# EAGLE design RoverBaseboard (EAGLE 6.4)
DATABASE: /home/mes/eagle/PARTSDB.txt
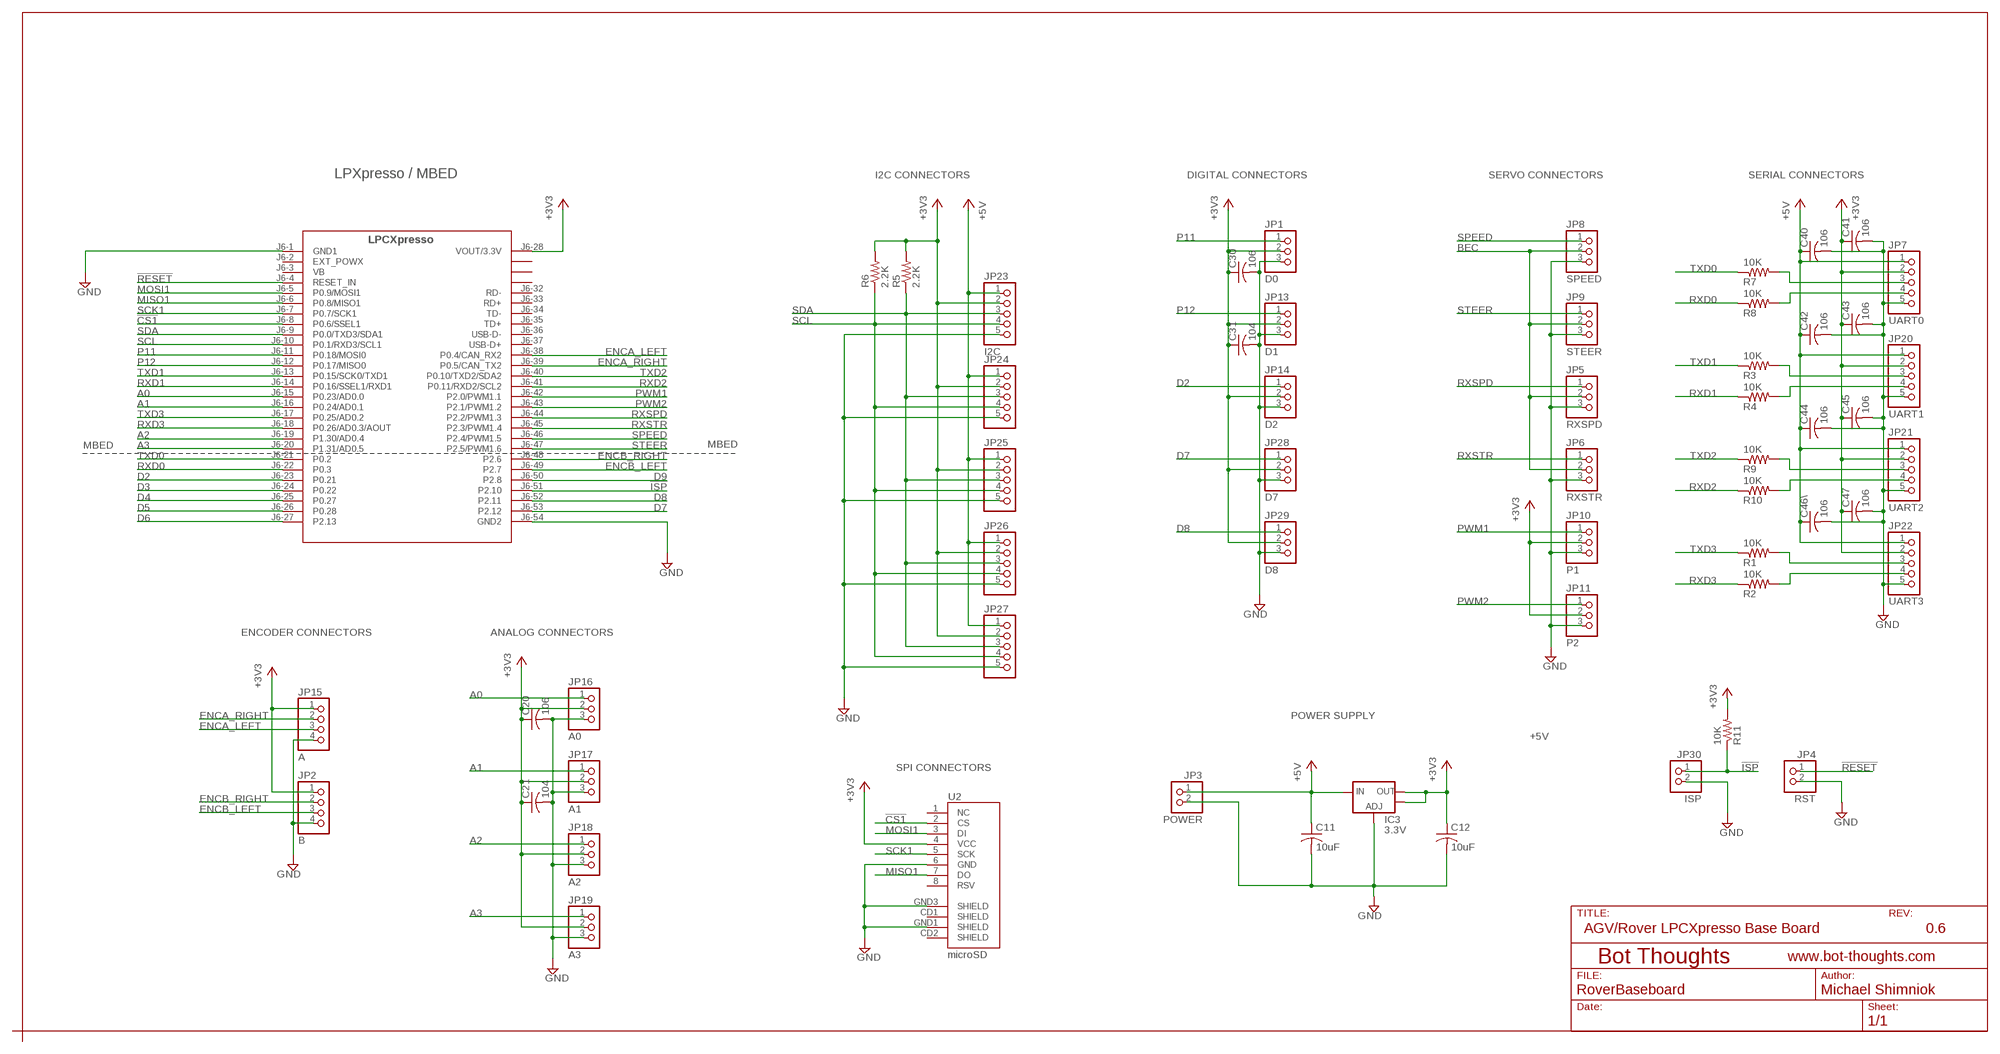
[diagram p0: schematic, sheet 1]

## Parts
C11  10uF  C-USC1206  [C1206]
C12  10uF  C-USC1206  [C1206]
C20  106  C-USC0603  [C0603]
C21  104  C-USC0603  [C0603]
C30  106  C-USC0603  [C0603]
C31  104  C-USC0603  [C0603]
C40  106  C-USC0603  [C0603]
C41  106  C-USC0603  [C0603]
C42  106  C-USC0603  [C0603]
C43  106  C-USC0603  [C0603]
C44  106  C-USC0603  [C0603]
C45  106  C-USC0603  [C0603]
C46\  106  C-USC0603  [C0603]
C47  106  C-USC0603  [C0603]
IC3  3.3V  V_REG_LM1117SOT223  [SOT223]
JP1  D0  PINHD-1X03_2.54-S  [1X03-S]
JP2  B  PINHD-1X04_2.54-S  [1X04-S]
JP3  POWER  PINHD-1X02_2.54-S  [1X02-S]
JP4  RST  PINHD-1X02_2.54-S  [1X02-S]
JP5  RXSPD  PINHD-1X03_2.54-S  [1X03-S]
JP6  RXSTR  PINHD-1X03_2.54-S  [1X03-S]
JP7  UART0  PINHD-1X05_2.54-S  [1X05-S]
JP8  SPEED  PINHD-1X03_2.54-S  [1X03-S]
JP9  STEER  PINHD-1X03_2.54-S  [1X03-S]
JP10  P1  PINHD-1X03_2.54-S  [1X03-S]
JP11  P2  PINHD-1X03_2.54-S  [1X03-S]
JP13  D1  PINHD-1X03_2.54-S  [1X03-S]
JP14  D2  PINHD-1X03_2.54-S  [1X03-S]
JP15  A  PINHD-1X04_2.54-S  [1X04-S]
JP16  A0  PINHD-1X03_2.54-S  [1X03-S]
JP17  A1  PINHD-1X03_2.54-S  [1X03-S]
JP18  A2  PINHD-1X03_2.54-S  [1X03-S]
JP19  A3  PINHD-1X03_2.54-S  [1X03-S]
JP20  UART1  PINHD-1X05_2.54-S  [1X05-S]
JP21  UART2  PINHD-1X05_2.54-S  [1X05-S]
JP22  UART3  PINHD-1X05_2.54-S  [1X05-S]
JP23  I2C  PINHD-1X05_2.54-S  [1X05-S]
JP24  PINHD-1X05_2.54-S  [1X05-S]
JP25  PINHD-1X05_2.54-S  [1X05-S]
JP26  PINHD-1X05_2.54-S  [1X05-S]
JP27  PINHD-1X05_2.54-S  [1X05-S]
JP28  D7  PINHD-1X03_2.54-S  [1X03-S]
JP29  D8  PINHD-1X03_2.54-S  [1X03-S]
JP30  ISP  PINHD-1X02_2.54-S  [1X02-S]
R1  10K  R-US_R0603  [R0603]
R2  10K  R-US_R0603  [R0603]
R3  10K  R-US_R0603  [R0603]
R4  10K  R-US_R0603  [R0603]
R5  2.2K  R-US_R0603  [R0603]
R6  2.2K  R-US_R0603  [R0603]
R7  10K  R-US_R0603  [R0603]
R8  10K  R-US_R0603  [R0603]
R9  10K  R-US_R0603  [R0603]
R10  10K  R-US_R0603  [R0603]
R11  10K  R-US_R0603  [R0603]
U2  microSD  USD-SOCKETNEW  [MICRO-SD-SOCKET-PP]
U$1  LPCXPRESSO  LPCXPRESSO_NO_PAD_1768_REVB  [LPCXPRESSO_NO_PAD]

## Nets
!CS1: U2.2(CS) U$1.J6-8(P0.6/SSEL1)
!ISP: JP30.1 R11.1 U$1.J6-51(P2.10)
!RESET: JP4.1 U$1.J6-4(RESET_IN)
+3V3: C12.1 C20.1 C21.1 C30.1 C31.1 C41.1 C43.1 C45.1 C47.1 IC3.2(OUT) IC3.4(OUT) JP1.2 JP2.1 JP7.2 JP10.2 JP11.2 JP13.2 JP14.2 JP15.1 JP16.2 JP17.2 JP18.2 JP19.2 JP20.2 JP21.2 JP22.2 JP23.2 JP24.2 JP25.2 JP26.2 JP27.2 JP28.2 JP29.2 R5.2 R6.2 R11.2 U2.4(VCC) U$1.J6-28(VOUT/3.3V)
+5V: C11.1 C40.1 C42.1 C44.1 C46\.1 IC3.3(IN) JP3.1 JP7.1 JP20.1 JP21.1 JP22.1 JP23.1 JP24.1 JP25.1 JP26.1 JP27.1
A0: JP16.1 U$1.J6-15(P0.23/AD0.0)
A1: JP17.1 U$1.J6-16(P0.24/AD0.1)
A2: JP18.1 U$1.J6-19(P1.30/AD0.4)
A3: JP19.1 U$1.J6-20(P1.31/AD0.5)
BEC: JP5.2 JP6.2 JP8.2 JP9.2
D2: JP14.1 U$1.J6-23(P0.21)
D3: U$1.J6-24(P0.22)
D4: U$1.J6-25(P0.27)
D5: U$1.J6-26(P0.28)
D6: U$1.J6-27(P2.13)
D7: JP28.1 U$1.J6-53(P2.12)
D8: JP29.1 U$1.J6-52(P2.11)
D9: U$1.J6-50(P2.8)
ENCA_LEFT: JP15.3 U$1.J6-38(P0.4/CAN_RX2)
ENCA_RIGHT: JP15.2 U$1.J6-39(P0.5/CAN_TX2)
ENCB_LEFT: JP2.3 U$1.J6-49(P2.7)
ENCB_RIGHT: JP2.2 U$1.J6-48(P2.6)
GND: C11.2 C12.2 C20.2 C21.2 C30.2 C31.2 C40.2 C41.2 C42.2 C43.2 C44.2 C45.2 C46\.2 C47.2 IC3.1(ADJ) JP1.3 JP2.4 JP3.2 JP4.2 JP5.3 JP6.3 JP7.5 JP8.3 JP9.3 JP10.3 JP11.3 JP13.3 JP14.3 JP15.4 JP16.3 JP17.3 JP18.3 JP19.3 JP20.5 JP21.5 JP22.5 JP23.5 JP24.5 JP25.5 JP26.5 JP27.5 JP28.3 JP29.3 JP30.2 U2.6(GND) U2.GND1(SHIELD) U2.GND3(SHIELD) U$1.J6-1(GND1) U$1.J6-54(GND2)
MISO1: U2.7(DO) U$1.J6-6(P0.8/MISO1)
MOSI1: U2.3(DI) U$1.J6-5(P0.9/MOSI1)
N$1: JP22.3 R1.2
N$2: JP22.4 R2.2
N$6: JP7.3 R7.2
N$7: JP7.4 R8.2
N$9: JP20.3 R3.2
N$10: JP20.4 R4.2
N$16: JP21.3 R9.2
N$17: JP21.4 R10.2
P11: JP1.1 U$1.J6-11(P0.18/MOSI0)
P12: JP13.1 U$1.J6-12(P0.17/MISO0)
PWM1: JP10.1 U$1.J6-42(P2.0/PWM1.1)
PWM2: JP11.1 U$1.J6-43(P2.1/PWM1.2)
RXD0: R8.1 U$1.J6-22(P0.3)
RXD1: R4.1 U$1.J6-14(P0.16/SSEL1/RXD1)
RXD2: R10.1 U$1.J6-41(P0.11/RXD2/SCL2)
RXD3: R2.1 U$1.J6-18(P0.26/AD0.3/AOUT)
RXSPD: JP5.1 U$1.J6-44(P2.2/PWM1.3)
RXSTR: JP6.1 U$1.J6-45(P2.3/PWM1.4)
SCK1: U2.5(SCK) U$1.J6-7(P0.7/SCK1)
SCL: JP23.4 JP24.4 JP25.4 JP26.4 JP27.4 R6.1 U$1.J6-10(P0.1/RXD3/SCL1)
SDA: JP23.3 JP24.3 JP25.3 JP26.3 JP27.3 R5.1 U$1.J6-9(P0.0/TXD3/SDA1)
SPEED: JP8.1 U$1.J6-46(P2.4/PWM1.5)
STEER: JP9.1 U$1.J6-47(P2.5/PWM1.6)
TXD0: R7.1 U$1.J6-21(P0.2)
TXD1: R3.1 U$1.J6-13(P0.15/SCK0/TXD1)
TXD2: R9.1 U$1.J6-40(P0.10/TXD2/SDA2)
TXD3: R1.1 U$1.J6-17(P0.25/AD0.2)
Unconnected: U2.1(NC) U2.8(RSV) U2.CD1(SHIELD) U2.CD2(SHIELD) U$1.J6-2(EXT_POWX) U$1.J6-3(VB) U$1.J6-29 U$1.J6-30 U$1.J6-31 U$1.J6-32(RD-) U$1.J6-33(RD+) U$1.J6-34(TD-) U$1.J6-35(TD+) U$1.J6-36(USB-D-) U$1.J6-37(USB-D+)

## Notes on the sheet
- LPXpresso / MBED | I2C CONNECTORS | DIGITAL CONNECTORS | SERVO CONNECTORS | SERIAL CONNECTORS
- MBED | MBED
- ENCODER CONNECTORS | ANALOG CONNECTORS
- POWER SUPPLY
- SPI CONNECTORS
- AGV/Rover LPCXpresso Base Board | 0.6

## Library data of the parts
C11 C12 C20 C21 C30 C31 C40-C45 C46\ C47 = rcl:C-US: CAPACITOR, American symbol
IC3 = SparkFun:V_REG_LM1117: Voltage Regulator LM1117 Standard adjustable voltage regulator but in SMD form. Spark Fun Electronics SKU : COM-00595
JP1 JP5 JP6 JP8-JP11 JP13 JP14 JP16-JP19 JP28 JP29 = pinhead-2:PINHD-1X03: PIN HEADER; OC_NEWARK: unknown
JP2 JP15 = pinhead-2:PINHD-1X04: PIN HEADER; OC_NEWARK: unknown
JP3 JP4 JP30 = pinhead-2:PINHD-1X02: PIN HEADER; OC_NEWARK: unknown
JP7 JP20-JP27 = pinhead-2:PINHD-1X05: PIN HEADER
R1-R4 R7-R11 = rcl:R-US_: RESISTOR, American symbol; MPN: WCR0805-220RFI; OC_NEWARK: 98K2621
R5 R6 = rcl:R-US_: RESISTOR, American symbol; OC_NEWARK: unknown
U2 = SparkFun:USD-SOCKET: microSD Socket Push-push type uSD socket. Schematic element and footprint production proven. Spark Fun Electronics SKU : PRT-00127. tDoc lines correctly indicate media card edge positions when inserting (unlocked, locked, depressed).
U$1 = LPCXpresso:LPCXPRESSO_NO_PAD: NXP LPCXpresso by Embedded Artists LPCXpresso is a new, low-cost development platform available from NXP. It supports NXP's ARM-based LPC microcontrollers. The platform is comprised of a simplified Eclipse-based IDE and low-cost target boards which include an attached JTAG debugger. http://ics.nxp.com/lpcxpresso/ NOTE: This version does NOT include the 37-pin pads on the top of the board

## Board
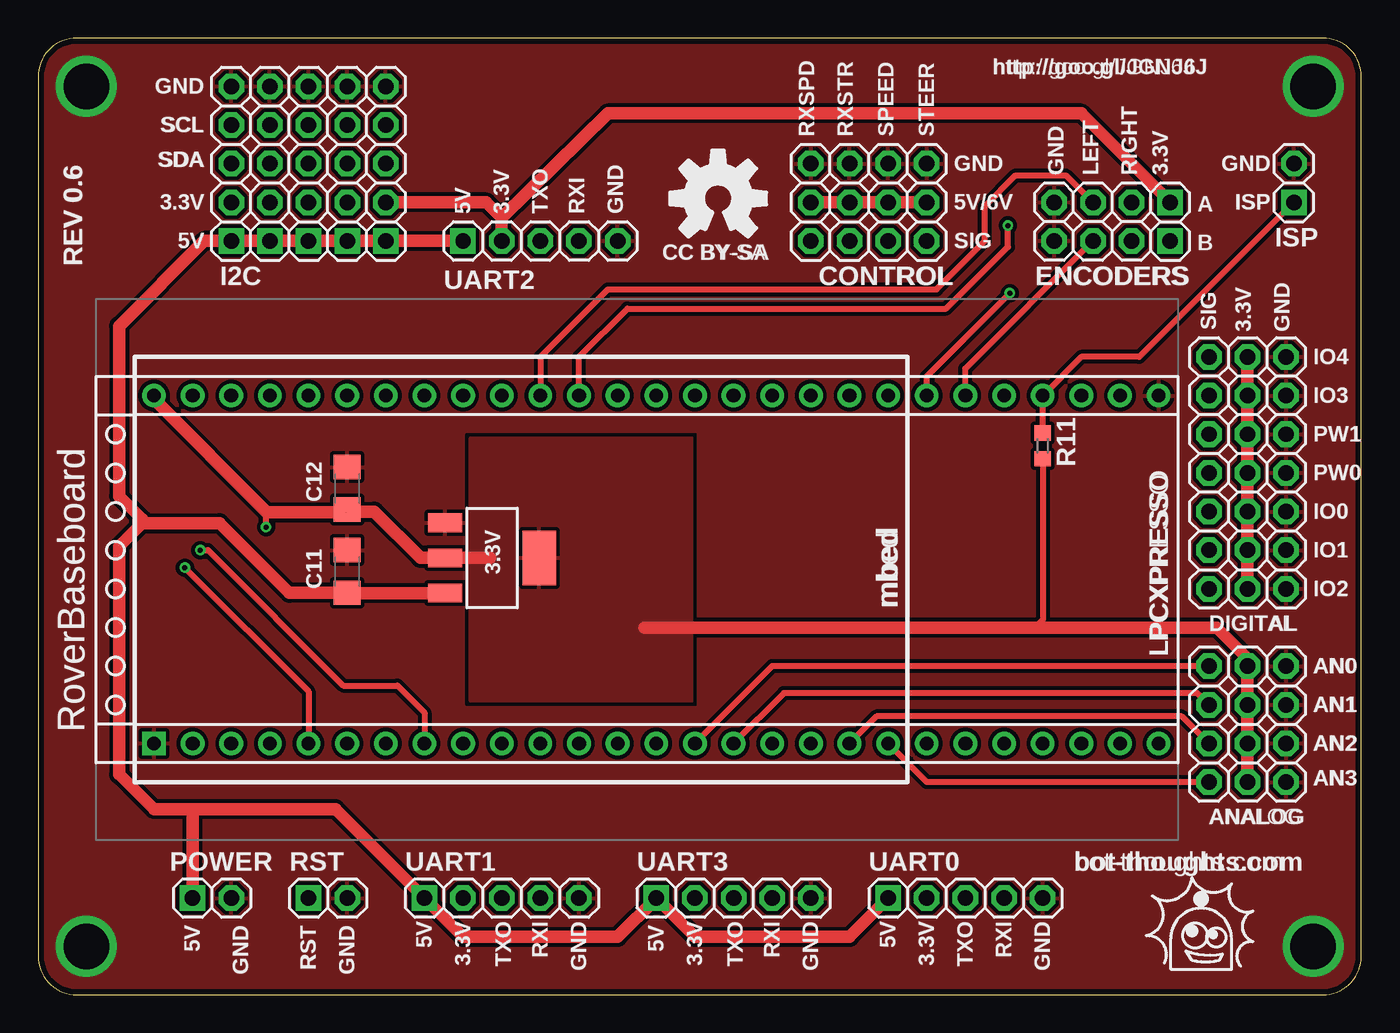
[diagram p1: board, top side]
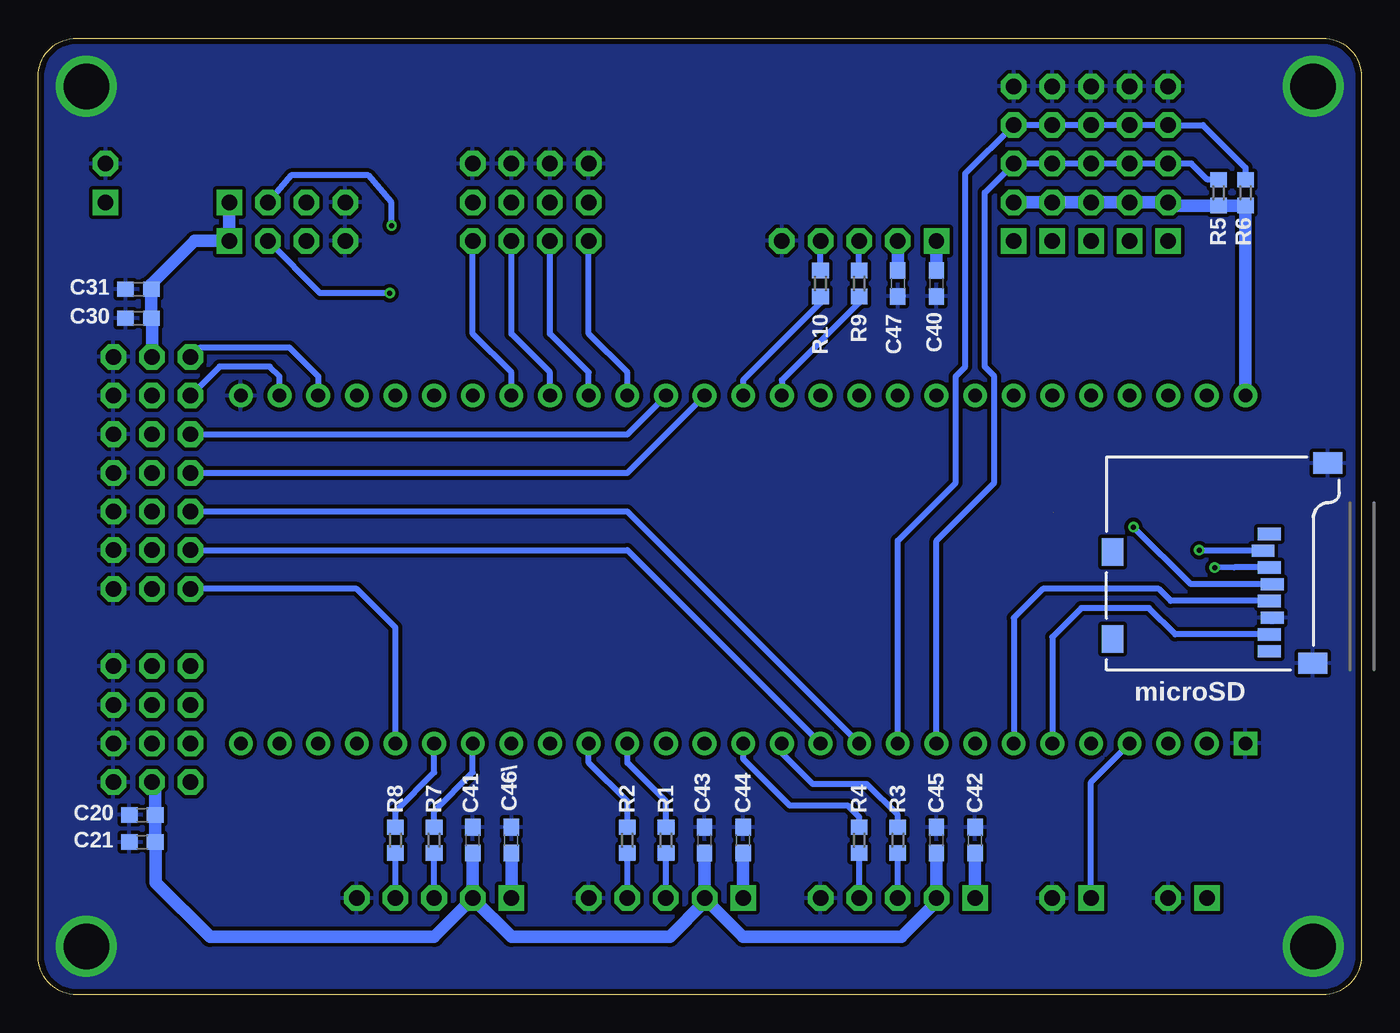
[diagram p2: board, bottom side, seen from below]

Size 87 x 62.87 mm. Coordinates in mm from the lower left corner, seen from the top.
Outline: 0,60.33 0,2.54 arc90 2.54,0 84.45,0 arc90 87,2.54 87,60.33 arc90 84.45,62.87 2.54,62.87 arc90 0,60.33
Copper layers (1*16): Top 0.0356mm / dielectric 1.5011mm / Bottom 0.0356mm
Design rules "default *": minimum track width 6mil, minimum drill 13mil, track to track 6mil, track to pad 6mil, pad to pad 6mil, via to via 6mil, smd to smd 6mil, copper to edge 15mil, drill to drill 6mil, minimum pad ring 13mil, minimum via ring 7mil, stop-mask expansion 4mil, vias tented up to drill 25mil, thermal gap 10mil

### Footprints (pad centres in the part's own frame; a part is rotated, then mirrored left to right if it is on the bottom)
C1206 = smd 1.6 x 1.8: 1 -1.4,0; 2 1.4,0
C0603 = smd 1.1 x 1: 1 -0.85,0; 2 0.85,0
SOT223 = smd 1.219 x 2.235: 1 -2.311,-3.099; 2 0,-3.099; 3 2.311,-3.099 | smd 3.6 x 2.2: 4 0,3.099
1X03-S = drill 1.016 octagon: 1 -2.54,0; 2 0,0; 3 2.54,0
1X04-S = drill 1.016 square: 1 -3.81,0 | drill 1.016 octagon: 2 -1.27,0; 3 1.27,0; 4 3.81,0
1X02-S = drill 1.016 square: 1 -1.27,0 | drill 1.016 octagon: 2 1.27,0
1X05-S = drill 1.016 square: 1 -5.08,0 | drill 1.016 octagon: 2 -2.54,0; 3 0,0; 4 2.54,0; 5 5.08,0
R0603 = smd 1 x 1.1: 1 -0.85,0; 2 0.85,0
MICRO-SD-SOCKET-PP = smd 0.8 x 1.5: 1 -8.94,10.7; 2 -7.84,10.3; 3 -6.74,10.7; 4 -5.64,10.9; 5 -4.54,10.7; 6 -3.44,10.9; 7 -2.34,10.7; 8 -1.24,10.7 | smd 1.8 x 1.4: CD1 -2.05,0.4; CD2 -7.75,0.4 | smd 1.4 x 1.9: GND1 -13.6,14.55; GND3 -0.45,13.55
LPCXPRESSO_NO_PAD = drill 0.9 pad 1.422 square: J6-1 -33.02,-11.43 | drill 0.9 pad 1.422: J6-2 -30.48,-11.43; J6-3 -27.94,-11.43; J6-4 -25.4,-11.43; J6-5 -22.86,-11.43; J6-6 -20.32,-11.43; J6-7 -17.78,-11.43; J6-8 -15.24,-11.43; J6-9 -12.7,-11.43; J6-10 -10.16,-11.43; J6-11 -7.62,-11.43; J6-12 -5.08,-11.43; J6-13 -2.54,-11.43; J6-14 0,-11.43; J6-15 2.54,-11.43; J6-16 5.08,-11.43; J6-17 7.62,-11.43; J6-18 10.16,-11.43; J6-19 12.7,-11.43; J6-20 15.24,-11.43; J6-21 17.78,-11.43; J6-22 20.32,-11.43; J6-23 22.86,-11.43; J6-24 25.4,-11.43; J6-25 27.94,-11.43; J6-26 30.48,-11.43; J6-27 33.02,-11.43; J6-28 -33.02,11.43; J6-29 -30.48,11.43; J6-30 -27.94,11.43; J6-31 -25.4,11.43; J6-32 -22.86,11.43; J6-33 -20.32,11.43; J6-34 -17.78,11.43; J6-35 -15.24,11.43; J6-36 -12.7,11.43; J6-37 -10.16,11.43; J6-38 -7.62,11.43; J6-39 -5.08,11.43; J6-40 -2.54,11.43; J6-41 0,11.43; J6-42 2.54,11.43; J6-43 5.08,11.43; J6-44 7.62,11.43; J6-45 10.16,11.43; J6-46 12.7,11.43; J6-47 15.24,11.43; J6-48 17.78,11.43; J6-49 20.32,11.43; J6-50 22.86,11.43; J6-51 25.4,11.43; J6-52 27.94,11.43; J6-53 30.48,11.43; J6-54 33.02,11.43

### Placement (x,y rotation side)
C11  20.32,27.81 90 top
C12  20.32,33.27 90 top
C20  80.14,11.81 180 bottom
C21  80.14,10.03 180 bottom
C30  80.39,44.45 180 bottom
C31  80.39,46.35 180 bottom
C40  27.94,46.74 270 bottom
C41  58.42,10.16 90 bottom
C42  25.4,10.16 90 bottom
C43  43.18,10.16 90 bottom
C44  40.64,10.16 90 bottom
C45  27.94,10.16 90 bottom
C46\  55.88,10.16 90 bottom
C47  30.48,46.74 270 bottom
IC3  29.84,28.7 270 top
JP1  79.5,31.75 0 top
JP2  70.61,49.53 180 top
JP3  11.43,6.35 0 top
JP4  19.05,6.35 0 top
JP5  50.8,52.07 90 top
JP6  53.34,52.07 90 top
JP7  60.96,6.35 0 top
JP8  55.88,52.07 90 top
JP9  58.42,52.07 90 top
JP10  79.5,34.29 0 top
JP11  79.5,36.83 0 top
JP13  79.5,29.21 0 top
JP14  79.5,26.67 0 top
JP15  70.61,52.07 180 top
JP16  79.5,21.59 0 top
JP17  79.5,19.05 0 top
JP18  79.5,16.51 0 top
JP19  79.5,13.97 0 top
JP20  30.48,6.35 0 top
JP21  33.02,49.53 0 top
JP22  45.72,6.35 0 top
JP23  12.7,54.61 90 top
JP24  15.24,54.61 90 top
JP25  17.78,54.61 90 top
JP26  20.32,54.61 90 top
JP27  22.86,54.61 90 top
JP28  79.5,39.37 0 top
JP29  79.5,41.91 0 top
JP30  82.55,53.34 90 top
R1  45.72,10.16 270 bottom
R2  48.26,10.16 270 bottom
R3  30.48,10.16 270 bottom
R4  33.02,10.16 270 bottom
R5  9.4,52.7 270 bottom
R6  7.62,52.7 270 bottom
R7  60.96,10.16 270 bottom
R8  63.5,10.16 270 bottom
R9  33.02,46.74 90 bottom
R10  35.56,46.74 90 bottom
R11  66.04,36.07 270 top
U2  16.76,21.34 270 bottom
U$1  40.64,27.94 0 top

### Tracks (layer width: path | path; a pad name or v marks a point on that pad's centre or on a via)
!CS1  (via drill 0.33)
  Top 0.406: v10.67,29.21 11.18,29.21 20.07,20.32 23.62,20.32 25.4,18.54 U$1.J6-8
  Bottom 0.406: U2.2 10.63,29.18 v10.67,29.21
!ISP
  Top 0.406: JP30.1 72.39,41.91 68.58,41.91 U$1.J6-51 R11.1
!RESET
  Bottom 0.406: JP4.1 17.78,13.97 U$1.J6-4
+3V3  (via drill 0.33)  (1 unrouted)
  Top 0.406: v14.99,30.73 14.99,31.75 | R11.2 66.04,24.64 65.53,24.13
  Top 0.813: JP29.2 JP28.2 JP11.2 JP10.2 JP1.2 JP13.2 JP14.2 | JP19.2 JP18.2 JP17.2 JP16.2 79.5,22.1 77.47,24.13 65.53,24.13 39.88,24.13 | U$1.J6-28 7.62,39.12 14.99,31.75 15.04,31.7 20.24,31.7 C12.1 | 20.27,31.7 20.32,31.75 22.1,31.75 25.15,28.7 IC3.2 29.72,28.7 | JP15.1 68.58,57.91 37.47,57.91 30.48,51.05 | JP21.2 30.48,51.05 | 30.48,51.05 29.46,52.07 JP27.2
  Bottom 0.406: U2.4 11.23,26.98 v14.99,30.73
  Bottom 0.813: JP27.2 JP26.2 JP25.2 JP24.2 JP23.2 12.48,51.85 R5.2 R6.2 U$1.J6-28 | C45.1 JP20.2 27.94,6.1 30.23,3.81 40.64,3.81 JP22.2 | C41.1 JP7.2 | C47.1 JP21.2 | JP29.2 79.5,44.41 C30.1 C31.1 79.54,46.7 76.71,49.53 JP2.1 JP15.1 | JP19.2 79.29,13.76 C20.1 C21.1 79.25,9.99 79.25,7.37 75.69,3.81 60.96,3.81 JP7.2 | C43.1 JP22.2 | JP22.2 43.18,6.1 45.47,3.81 55.88,3.81 JP7.2
  pour Top (isolate 0.254): 28.45,36.58 42.93,36.58 42.93,19.3 28.45,19.3
+5V
  Top 0.813: JP7.1 53.34,3.81 43.18,3.81 JP22.1 38.1,3.81 27.94,3.81 JP20.1 19.56,12.19 10.29,12.19 | 6.86,31.24 5.33,32.77 5.33,43.94 10.92,49.53 JP23.1 JP24.1 JP25.1 JP26.1 JP27.1 JP21.1 | 6.86,31.24 7.11,30.99 11.94,30.99 16.51,26.41 C11.1 20.34,26.39 IC3.3 | 6.86,31.24 6.86,30.99 5.33,29.46 5.33,14.48 7.62,12.19 10.29,12.19 | JP3.1 10.16,12.06 10.29,12.19
  Bottom 0.813: C42.1 JP20.1 | C44.1 JP22.1 | C46\.1 JP7.1 | C40.1 JP21.1
A0
  Top 0.406: JP16.1 48.26,21.59 U$1.J6-15
A1
  Top 0.406: JP17.1 76.2,19.81 49.02,19.81 U$1.J6-16
A2
  Top 0.406: JP18.1 75.18,18.29 55.12,18.29 U$1.J6-19
A3
  Top 0.406: JP19.1 58.42,13.97 U$1.J6-20
BEC
  Top 0.813: JP5.2 JP6.2 JP8.2 JP9.2
D2
  Bottom 0.406: U$1.J6-23 63.5,24.13 66.04,26.67 JP14.1
D7
  Bottom 0.406: U$1.J6-53 71.12,40.64 71.75,41.27 75.06,41.27 JP28.1
D8
  Bottom 0.406: JP29.1 76.33,42.55 70.48,42.55 68.58,40.64 U$1.J6-52
ENCA_LEFT
  Top 0.406: U$1.J6-38 33.02,41.91 37.47,46.35 59.05,46.35 62.23,49.53 62.23,51.82 64.26,53.85 67.56,53.85 JP15.3
ENCA_RIGHT  (via drill 0.33)
  Top 0.406: U$1.J6-39 35.56,41.91 38.73,45.09 59.69,45.09 63.75,49.15 v63.75,50.55
  Bottom 0.406: v63.75,50.55 63.75,52.07 65.28,53.85 70.36,53.85 JP15.2
ENCB_LEFT
  Top 0.406: U$1.J6-49 60.96,41.15 JP2.3
ENCB_RIGHT  (via drill 0.33)
  Top 0.406: U$1.J6-48 58.42,40.64 v63.88,46.1
  Bottom 0.406: v63.88,46.1 68.45,46.1 JP2.2
GND  (via drill 3)
  other vias: 3.17,59.69 83.82,59.69 83.82,3.17 3.17,3.17
  pour Bottom (isolate 0.254, rank 3): 84.45,0 2.54,0 arc-90 0,2.54 0,60.33 arc-90 2.54,62.87 84.45,62.87 arc-90 87,60.33 87,2.54 arc-90
  pour Top (isolate 0.254, rank 2): 84.45,0 2.54,0 arc-90 0,2.54 0,60.33 arc-90 2.54,62.87 84.45,62.87 arc-90 87,60.33 87,2.54 arc-90
MISO1
  Bottom 0.406: U2.7 12.25,23.68 13.97,25.4 18.41,25.4 20.32,23.5 U$1.J6-6
MOSI1  (via drill 0.33)
  Top 0.406: v9.65,28.07 17.78,19.94 U$1.J6-5
  Bottom 0.406: U2.3 8.37,28.08 v9.65,28.07
N$1
  Bottom 0.406: JP22.3 R1.2
N$2
  Bottom 0.406: JP22.4 R2.2
N$6
  Bottom 0.406: JP7.3 R7.2
N$7
  Bottom 0.406: JP7.4 R8.2
N$9
  Bottom 0.406: JP20.3 R3.2
N$10
  Bottom 0.406: R4.2 JP20.4
N$16
  Bottom 0.406: R9.2 JP21.3
N$17
  Bottom 0.406: R10.2 JP21.4
P11
  Bottom 0.406: U$1.J6-11 48.26,31.75 JP1.1
P12
  Bottom 0.406: JP13.1 48.26,29.21 U$1.J6-12
PWM1
  Bottom 0.406: JP10.1 48.26,34.29 U$1.J6-42
PWM2
  Bottom 0.406: JP11.1 48.26,36.83 U$1.J6-43
RXD0
  Bottom 0.406: R8.1 63.5,12.06 60.96,14.61 U$1.J6-22
RXD1
  Bottom 0.406: U$1.J6-14 40.64,15.49 37.59,12.45 33.78,12.45 33.02,11.68 R4.1
RXD2
  Bottom 0.406: R10.1 35.56,45.72 35.56,45.47 40.64,40.39 U$1.J6-41
RXD3
  Bottom 0.406: R2.1 48.26,12.7 50.8,15.24 U$1.J6-18
RXSPD
  Bottom 0.406: U$1.J6-44 48.26,40.89 50.8,43.43 JP5.1
RXSTR
  Bottom 0.406: U$1.J6-45 50.8,40.89 53.34,43.43 JP6.1
SCK1
  Bottom 0.406: U2.5 12.54,25.88 13.34,26.67 20.95,26.67 22.86,24.77 U$1.J6-7
SCL
  Bottom 0.406: U$1.J6-10 30.48,29.84 26.67,33.66 26.67,40.64 26.04,41.27 26.04,53.98 JP27.4 JP26.4 JP25.4 JP24.4 JP23.4 10.41,57.15 7.62,54.36 R6.1
SDA
  Bottom 0.406: R5.1 10.12,53.55 11.18,54.61 JP23.3 JP24.3 JP25.3 JP26.3 JP27.3 24.77,52.7 24.77,41.27 24.13,40.64 24.13,33.66 27.94,29.84 U$1.J6-9
SPEED
  Bottom 0.406: U$1.J6-46 53.34,40.89 55.88,43.43 JP8.1
STEER
  Bottom 0.406: U$1.J6-47 55.88,40.89 58.42,43.43 JP9.1
TXD0
  Bottom 0.406: R7.1 60.96,12.06 58.42,14.61 U$1.J6-21
TXD1
  Bottom 0.406: R3.1 30.48,11.81 32.51,13.84 36.07,13.84 38.1,15.88 U$1.J6-13
TXD2
  Bottom 0.406: R9.1 33.02,45.72 33.02,45.47 38.1,40.39 U$1.J6-40
TXD3
  Bottom 0.406: R1.1 45.72,12.7 48.26,15.24 U$1.J6-17

### Text on the board
tPlace: mbed
tNames: GND | http://goo.gl/JGNJ6J | SCL | SDA | GND | GND | GND | LEFT | RIGHT | 3.3V | 3.3V | ISP | 5V/6V | 5V | 3.3V | TXO | RXI | GND | 5V | SIG | REV 0.6 | CC BY-SA | CONTROL | ENCODERS | SIG | 3.3V | GND | IO4 | IO3 | PW1 | PW0 | IO0 | IO1 | IO2 | DIGITAL | AN0 | AN1 | RoverBaseboard | AN2 | AN3 | ANALOG | bot-thoughts.com | 5V | GND | RST | GND | 5V | 3.3V | TXO | RXI | GND | 5V | 3.3V | TXO | RXI | GND | 5V | 3.3V | TXO | RXI | GND
tsilk: GND | http://goo.gl/JGNJ6J | SCL | RXSPD | RXSTR | SPEED | STEER | SDA | GND | GND | GND | LEFT | RIGHT | 3.3V | 3.3V | ISP | 5V/6V | 5V | 3.3V | TXO | RXI | GND | A | 5V | SIG | B | ISP | REV 0.6 | CC BY-SA | I2C | CONTROL | ENCODERS | UART2 | SIG | 3.3V | GND | IO4 | IO3 | R11 | PW1 | PW0 | C12 | 3.3V | IO0 | IO1 | C11 | IO2 | mbed | DIGITAL | LPCXPRESSO | AN0 | AN1 | RoverBaseboard | AN2 | AN3 | ANALOG | POWER | RST | UART1 | UART3 | UART0 | bot-thoughts.com | 5V | GND | RST | GND | 5V | 3.3V | TXO | RXI | GND | 5V | 3.3V | TXO | RXI | GND | 5V | 3.3V | TXO | RXI | GND
bsilk: R6 | R5 | C31 | C40 | C47 | R9 | R10 | C30 | microSD | C42 | C45 | R3 | R4 | C44 | C43 | R1 | R2 | C46\ | C41 | R7 | R8 | C20 | C21